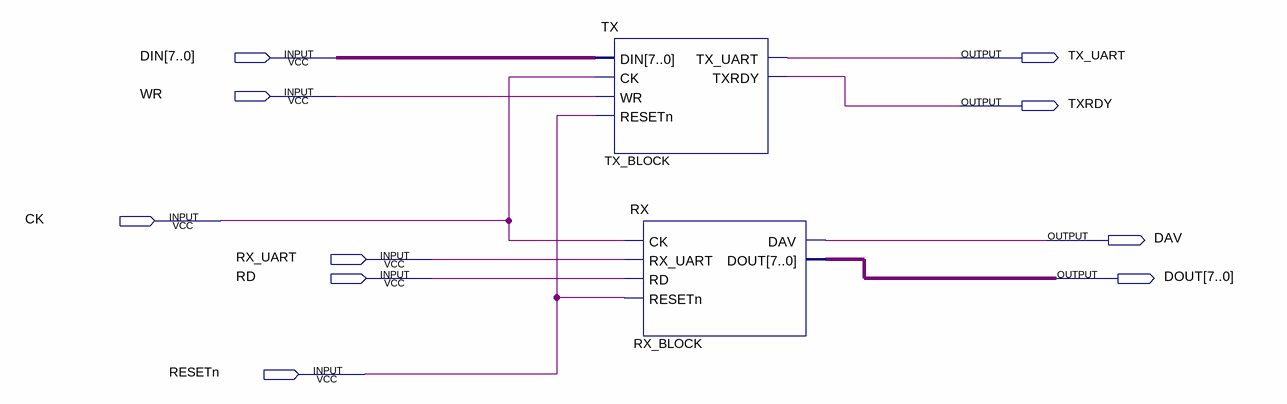
[diagram p0: schematic sheet]
// Quartus schematic UART.bdf as structural Verilog: 2 symbols, 10 pins
module UART (
  input  [7:0] DIN,
  input  WR,
  input  CK,
  input  RX_UART,
  input  RD,
  input  RESETn,
  output TX_UART,
  output TXRDY,
  output DAV,
  output [7:0] DOUT
);

  TX TX_BLOCK (.DIN(DIN), .CK(CK), .WR(WR), .RESETn(RESETn), .TX_UART(TX_UART), .TXRDY(TXRDY));
  RX RX_BLOCK (.CK(CK), .RX_UART(RX_UART), .RD(RD), .RESETn(RESETn), .DAV(DAV), .DOUT(DOUT));
endmodule
